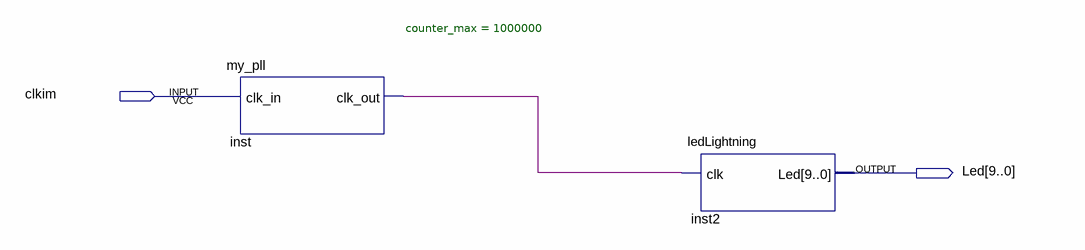
[diagram p0: schematic sheet]
// Quartus schematic Lab4.bdf as structural Verilog: 2 symbols, 2 pins
module Lab4 (
  input  clkim,
  output [9:0] Led
);

  wire inst_clk_out;

  my_pll #(.counter_max(1000000)) inst (.clk_in(clkim), .clk_out(inst_clk_out));
  ledLightning inst2 (.clk(inst_clk_out), .Led(Led));
endmodule
